# Altium schematic sheet Digit8.SCHDOC
size A4 portrait; Organization: Altium Limited; Address1: L3, 12a Rodborough Rd; Address2: Frenchs Forest; Address3: NSW; Address4: Australia 2086; DocumentNumber: 2; SheetNumber: 2; SheetTotal: 6
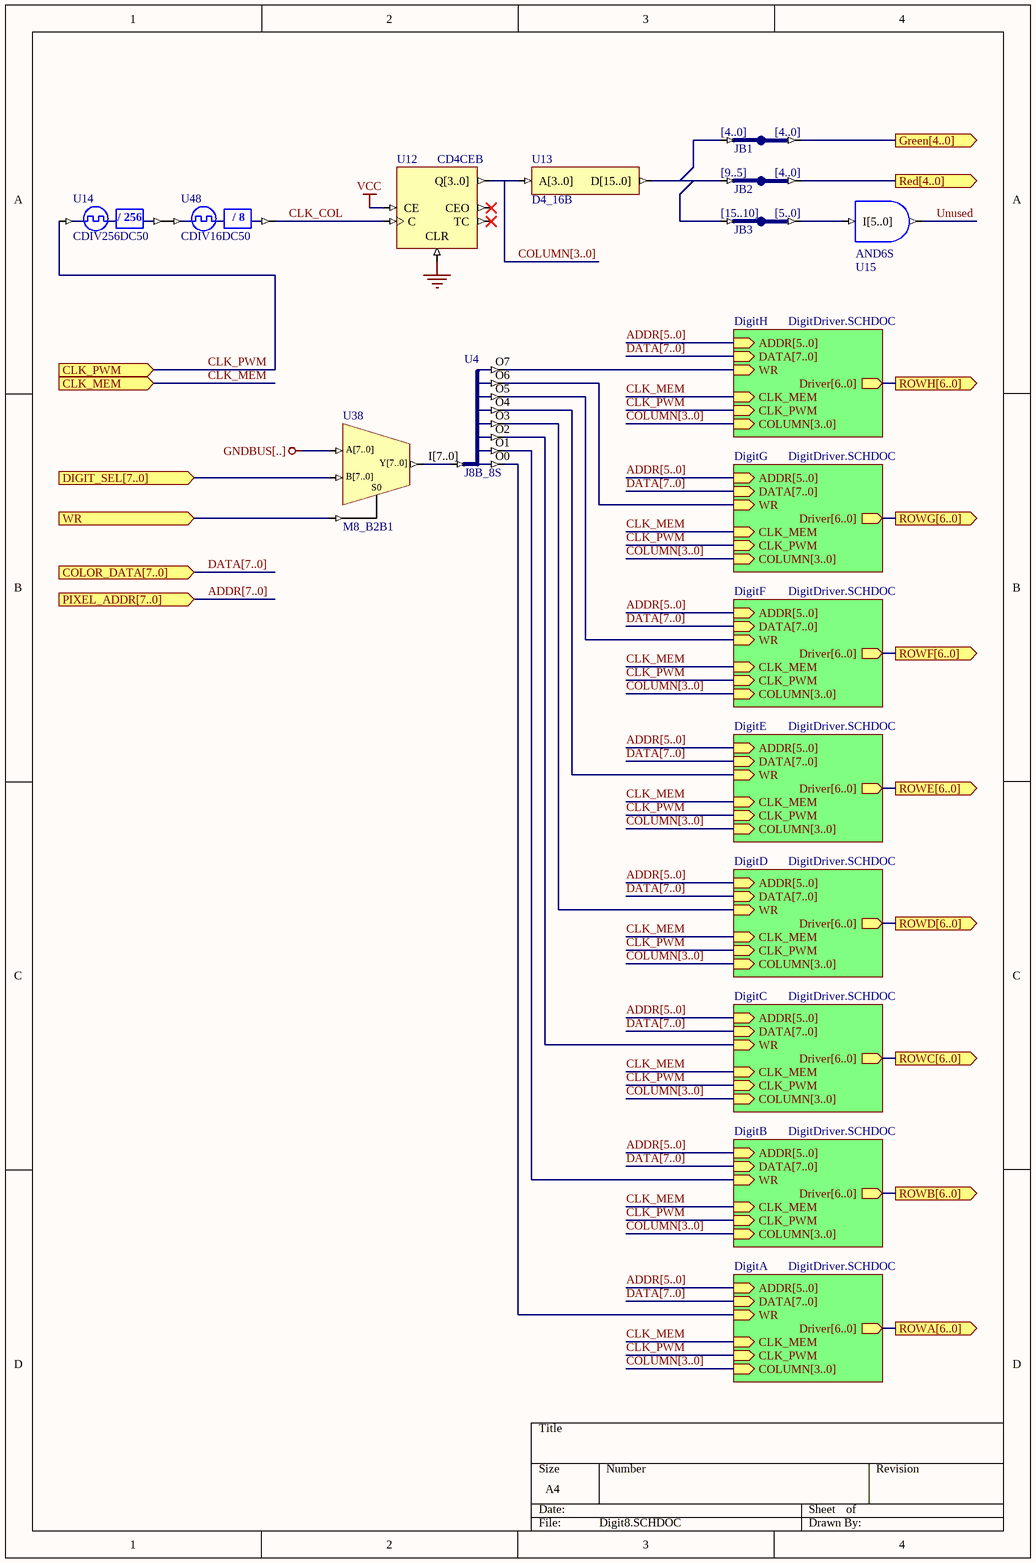
[diagram p0: Digit8.SCHDOC]

## Parts
JB1  IndexA: [4..0]  (hidden comment: JB)
JB2  IndexA: [9..5]  IndexB: [4..0]  (hidden comment: JB)
JB3  IndexA: [15..10]  IndexB: [5..0]  (hidden comment: JB)
U4  J8B_8S
U12  CD4CEB
U13  D4_16B
U14  CDIV256DC50
U15  AND6S
U38  M8_B2B1
U48  CDIV16DC50

## Sub-sheets
DigitA = DigitDriver.SCHDOC: COLUMN[3..0] (in), ADDR[5..0] (in), WR (in), DATA[7..0] (in), CLK_PWM (in), Driver[6..0] (out), CLK_MEM (in)
DigitB = DigitDriver.SCHDOC: COLUMN[3..0] (in), ADDR[5..0] (in), WR (in), DATA[7..0] (in), CLK_PWM (in), Driver[6..0] (out), CLK_MEM (in)
DigitC = DigitDriver.SCHDOC: COLUMN[3..0] (in), ADDR[5..0] (in), WR (in), DATA[7..0] (in), CLK_PWM (in), Driver[6..0] (out), CLK_MEM (in)
DigitD = DigitDriver.SCHDOC: COLUMN[3..0] (in), ADDR[5..0] (in), WR (in), DATA[7..0] (in), CLK_PWM (in), Driver[6..0] (out), CLK_MEM (in)
DigitE = DigitDriver.SCHDOC: COLUMN[3..0] (in), ADDR[5..0] (in), WR (in), DATA[7..0] (in), CLK_PWM (in), Driver[6..0] (out), CLK_MEM (in)
DigitF = DigitDriver.SCHDOC: COLUMN[3..0] (in), ADDR[5..0] (in), WR (in), DATA[7..0] (in), CLK_PWM (in), Driver[6..0] (out), CLK_MEM (in)
DigitG = DigitDriver.SCHDOC: COLUMN[3..0] (in), ADDR[5..0] (in), WR (in), DATA[7..0] (in), CLK_PWM (in), Driver[6..0] (out), CLK_MEM (in)
DigitH = DigitDriver.SCHDOC: COLUMN[3..0] (in), ADDR[5..0] (in), WR (in), DATA[7..0] (in), CLK_PWM (in), Driver[6..0] (out), CLK_MEM (in)

## Ports
CLK_MEM (in), CLK_PWM (in), COLOR_DATA[7..0] (in), DIGIT_SEL[7..0] (in), Green[4..0] (out), PIXEL_ADDR[7..0] (in), Red[4..0] (out), ROWA[6..0] (out), ROWB[6..0] (out), ROWC[6..0] (out), ROWD[6..0] (out), ROWE[6..0] (out), ROWF[6..0] (out), ROWG[6..0] (out), ROWH[6..0] (out), WR (in)

## Nets
GND: U12.CLR
GNDBUS[..]: U38.A[7..0]
VCC: U12.CE
CLK_COL: U12.C U48.CLKDV
CLK_MEM: port CLK_MEM, sheet DigitA/CLK_MEM, sheet DigitB/CLK_MEM, sheet DigitC/CLK_MEM, sheet DigitD/CLK_MEM, sheet DigitE/CLK_MEM, sheet DigitF/CLK_MEM, sheet DigitG/CLK_MEM, sheet DigitH/CLK_MEM
CLK_PWM: U14.CLKIN ; port CLK_PWM, sheet DigitA/CLK_PWM, sheet DigitB/CLK_PWM, sheet DigitC/CLK_PWM, sheet DigitD/CLK_PWM, sheet DigitE/CLK_PWM, sheet DigitF/CLK_PWM, sheet DigitG/CLK_PWM, sheet DigitH/CLK_PWM
COLUMN[3..0]: U12.Q[3..0] U13.A[3..0] ; sheet DigitA/COLUMN[3..0], sheet DigitB/COLUMN[3..0], sheet DigitC/COLUMN[3..0], sheet DigitD/COLUMN[3..0], sheet DigitE/COLUMN[3..0], sheet DigitF/COLUMN[3..0], sheet DigitG/COLUMN[3..0], sheet DigitH/COLUMN[3..0]
DIGIT_SEL[7..0]: U38.B[7..0] ; port DIGIT_SEL[7..0]
Green[4..0]: JB1.B[0..0] ; port Green[4..0]
Red[4..0]: JB2.B[0..0] ; port Red[4..0]
Unused: U15.O
WR: U38.S0 ; port WR
NetJB1_A[0..0]: JB1.A[0..0] JB2.A[0..0] JB3.A[0..0] U13.D[15..0]
NetJB3_B[0..0]: JB3.B[0..0] U15.I[5..0]
NetU4_I[7..0]: U4.I[7..0] U38.Y[7..0]
NetU4_O0: U4.O0 ; sheet DigitA/WR
NetU4_O1: U4.O1 ; sheet DigitB/WR
NetU4_O2: U4.O2 ; sheet DigitC/WR
NetU4_O3: U4.O3 ; sheet DigitD/WR
NetU4_O4: U4.O4 ; sheet DigitE/WR
NetU4_O5: U4.O5 ; sheet DigitF/WR
NetU4_O6: U4.O6 ; sheet DigitG/WR
NetU4_O7: U4.O7 ; sheet DigitH/WR
NetU14_CLKDV: U14.CLKDV U48.CLKIN

Not connected (* = marked no-connect by the designer): U12 CEO* TC*

## Buses and harness runs
bus ADDR[5..0] = sheet DigitA/ADDR[5..0]
bus ADDR[5..0] = sheet DigitB/ADDR[5..0]
bus ADDR[5..0] = sheet DigitC/ADDR[5..0]
bus ADDR[5..0] = sheet DigitD/ADDR[5..0]
bus ADDR[5..0] = sheet DigitE/ADDR[5..0]
bus ADDR[5..0] = sheet DigitF/ADDR[5..0]
bus ADDR[5..0] = sheet DigitG/ADDR[5..0]
bus ADDR[5..0] = sheet DigitH/ADDR[5..0]
bus ADDR[7..0] = port PIXEL_ADDR[7..0]
bus COLUMN[3..0]
bus COLUMN[3..0] = sheet DigitA/COLUMN[3..0]
bus COLUMN[3..0] = sheet DigitB/COLUMN[3..0]
bus COLUMN[3..0] = sheet DigitC/COLUMN[3..0]
bus COLUMN[3..0] = sheet DigitD/COLUMN[3..0]
bus COLUMN[3..0] = sheet DigitE/COLUMN[3..0]
bus COLUMN[3..0] = sheet DigitF/COLUMN[3..0]
bus COLUMN[3..0] = sheet DigitG/COLUMN[3..0]
bus COLUMN[3..0] = sheet DigitH/COLUMN[3..0]
bus DATA[7..0] = port COLOR_DATA[7..0]
bus DATA[7..0] = sheet DigitA/DATA[7..0]
bus DATA[7..0] = sheet DigitB/DATA[7..0]
bus DATA[7..0] = sheet DigitC/DATA[7..0]
bus DATA[7..0] = sheet DigitD/DATA[7..0]
bus DATA[7..0] = sheet DigitE/DATA[7..0]
bus DATA[7..0] = sheet DigitF/DATA[7..0]
bus DATA[7..0] = sheet DigitG/DATA[7..0]
bus DATA[7..0] = sheet DigitH/DATA[7..0]
bus port ROWA[6..0] = sheet DigitA/Driver[6..0]
bus port ROWB[6..0] = sheet DigitB/Driver[6..0]
bus port ROWC[6..0] = sheet DigitC/Driver[6..0]
bus port ROWD[6..0] = sheet DigitD/Driver[6..0]
bus port ROWE[6..0] = sheet DigitE/Driver[6..0]
bus port ROWF[6..0] = sheet DigitF/Driver[6..0]
bus port ROWG[6..0] = sheet DigitG/Driver[6..0]
bus port ROWH[6..0] = sheet DigitH/Driver[6..0]

## Notes on the sheet
- Labels drawn without touching a wire or pin: GNDBUS[..]
- Title
- Size:
- Date:
- A4
- Number:
- Time:
- Revision:
- Sheet
- of
- File:
- (in symbol CDIV8DC50) / 8
- (in symbol CDIV256DC50) / 256

## Library data of the parts
JB1-JB3 = JB: System Joiner; ArchiveName: GENERIC; Publisher: Altium Limited; Core Revision: 1.00.00
  JB1: IndexB: [4..0]
U4 = J8B_8S: 8-Bit input bus to 8 single pin outputs; ArchiveName: GENERIC; Published: 18-Nov-2003; Publisher: Altium Limited; Core Revision: 1.00.00
U12 = CD4CEB: 4-Bit Cascadable BCD Counter with Clock Enable and Asynchronous Clear, Bus Version; ArchiveName: GENERIC; Published: 18-Dec-2003; Publisher: Altium Limited; Core Revision: 1.00.00
U13 = D4_16B: Binary 4- to 16-Bit Decoder, Bus Version; ArchiveName: GENERIC; Published: 7-Nov-2003; Publisher: Altium Limited; Core Revision: 1.00.00
U14 = CDIV256DC50: Clock Divider by 256 with 50% Duty Cycle Output; ArchiveName: GENERIC; Published: 18-Dec-2003; Publisher: Altium Limited; Core Revision: 1.00.00
U15 = AND6B: 6-Input AND Gate, Bus Version; ArchiveName: GENERIC; Publisher: Altium Limited; Core Revision: 1.00.00
U38 = M8_B2B1: 2x8-Bit Bus to 1x8-Bit Bus Multiplexer; ArchiveName: GENERIC; Published: 18-Nov-2003; Publisher: Altium Limited; Core Revision: 1.00.00
U48 = CDIV8DC50: Clock Divider by 8 with 50% Duty Cycle Output; ArchiveName: GENERIC; Xilinx Equivalent: CLK_DIV8; Published: 18-Dec-2003; Publisher: Altium Limited; Core Revision: 1.00.00